# EAGLE schematic Main board V4.0 (EAGLE 6.2)

## Sheet 1 of 4
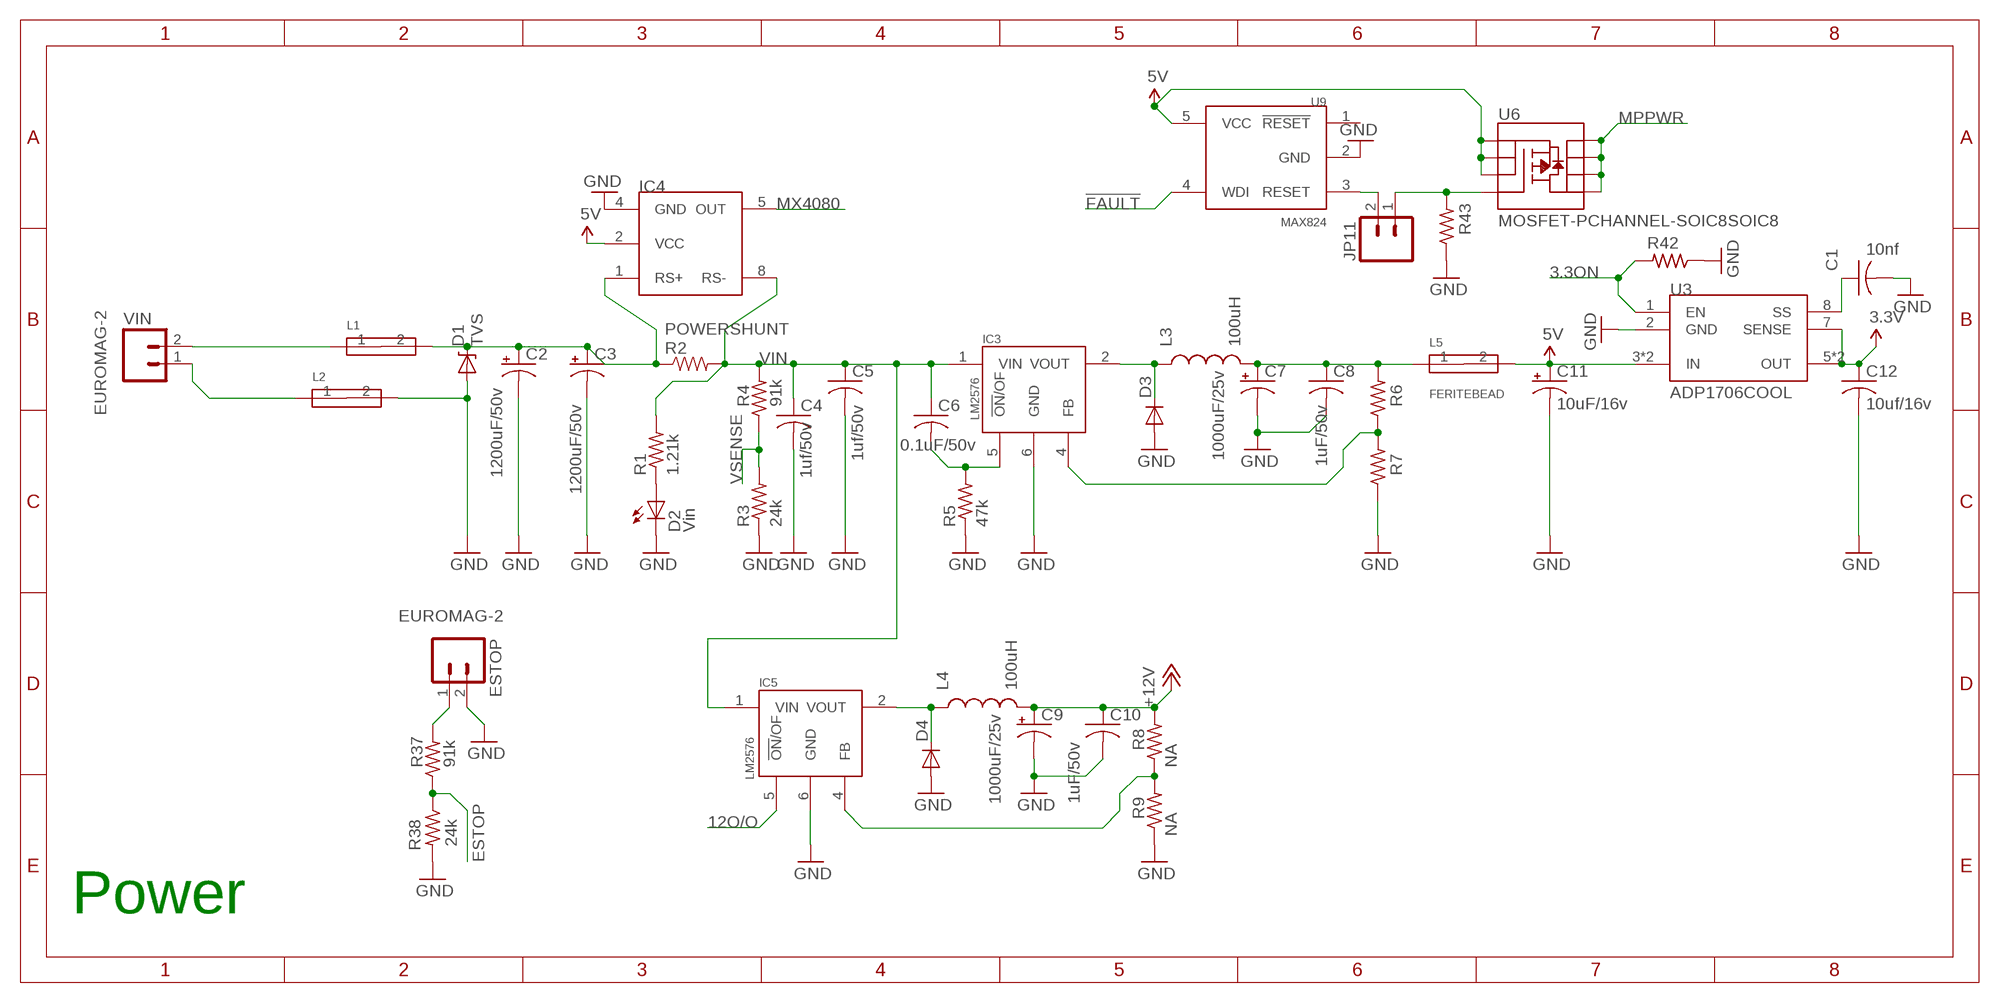
[diagram p0: schematic, sheet 1]

### Parts
C1  10nf  C-USC0805  [C0805]
C2  1200uF/50v  CAP_CAN1  [CAN_18MM]
C3  1200uF/50v  CAP_CAN1  [CAN_18MM]
C4  1uf/50v  C-USC0805  [C0805]
C5  1uf/50v  C-USC0805  [C0805]
C6  0.1uF/50v  C-USC0805  [C0805]
C7  1000uF/25v  CAP_CAN1  [CAN_18MM]
C8  1uF/50v  C-USC0805  [C0805]
C9  1000uF/25v  CAP_CAN1  [CAN_18MM]
C10  1uF/50v  C-USC0805  [C0805]
C11  10uF/16v  CPOL-USE3.5-10  [E3,5-10]
C12  10uf/16v  C-USC0805  [C0805]
D1  TVS  [DO-214AC]
D2  Vin  LEDCHIP-LED0805  [CHIP-LED0805]
D3  DIODE-SMC  [SMC]
D4  DIODE-SMC  [SMC]
ESTOP  EUROMAG-2  [M2]
IC3  LM2576  [TO-263-5]
IC4  MAX4080  [SO08]
IC5  LM2576  [TO-263-5]
JP11  M02LOCK_LONGPADS  [1X02_LOCK_LONGPADS]
L1  FERITEBEAD  [0603]
L2  FERITEBEAD  [0603]
L3  100uH  INDUCTOR  [INDUCTOR_5X3]
L4  100uH  INDUCTOR  [INDUCTOR_5X3]
L5  FERITEBEAD  [0603]
R1  1.21k  R-US_R0805  [R0805]
R2  POWERSHUNT  [RW3R5EAR100JE]
R3  24k  R-US_R0805  [R0805]
R4  91k  R-US_R0805  [R0805]
R5  47k  R-US_R0805  [R0805]
R6  NA  R-US_R0805  [R0805]
R7  NA  R-US_R0805  [R0805]
R8  NA  R-US_R0805  [R0805]
R9  NA  R-US_R0805  [R0805]
R37  91k  R-US_R0805  [R0805]
R38  24k  R-US_R0805  [R0805]
R42  NA  R-US_R0805  [R0805]
R43  NA  R-US_R0805  [R0805]
U3  ADP1706COOL  [SO-8COOL]
U6  MOSFET-PCHANNEL-SOIC8SOIC8  [SO08]
U9  MAX824  [SOT-5L]
VIN  EUROMAG-2  [M2]

### Nets
3.3ON: R42.2 U3.1(EN) ; also sheet 2
3.3V: C12.1 U3.5(OUT) U3.6(OUT) U3.7(SENSE) ; also sheet 2,3
5V: C11.+ IC4.2(VCC) L5.2 U3.3(IN) U3.4(IN) U6.1(S) U6.2(S) U6.3(S) U9.5(VCC) ; also sheet 2,3,4
12O/O: IC5.5(!ON!/OF) ; also sheet 2
!FAULT: U9.4(WDI) ; also sheet 2
+12V: C9.+ C10.1 L4.2 R8.2 ; also sheet 2,3
ESTOP: R37.1 R38.1 ; also sheet 3
GND: C1.2 C2.- C3.- C4.2 C5.2 C7.- C8.2 C9.- C10.2 C11.- C12.2 D1.A D2.C D3.A D4.A ESTOP.2 IC3.6(GND) IC4.4(GND) IC5.6(GND) L2.2 R3.1 R5.1 R7.1 R9.1 R38.2 R42.1 R43.1 U3.2(GND) U9.2(GND) ; also sheet 2,3,4
MPPWR: U6.5(D) U6.6(D) U6.7(D) U6.8(D) ; also sheet 2,3
MX4080: IC4.5(OUT) ; also sheet 3
N$1: C6.2 IC3.5(!ON!/OF) R5.2
N$4: D4.C IC5.2(VOUT) L4.1
N$19: D3.C IC3.2(VOUT) L3.1
N$20: JP11.1 R43.2 U6.4(G)
N$21: JP11.2 U9.3(RESET)
N$25: L1.1 VIN.2
N$27: ESTOP.1 R37.2
N$33: C2.+ C3.+ D1.C IC4.1(RS+) L1.2 R2.1
N$37: IC3.4(FB) R6.1 R7.2
N$38: IC5.4(FB) R8.1 R9.2
N$42: D2.A R1.1
N$45: L2.1 VIN.1
N$46: C7.+ C8.1 L3.2 L5.1 R6.2
N$78: C1.1 U3.8(SS)
VIN [power]: C4.1 C5.1 C6.1 IC3.1(VIN) IC4.8(RS-) IC5.1(VIN) R1.2 R2.2 R4.2
VSENSE: R3.2 R4.1 ; also sheet 3
Unconnected: U9.1(!RESET)

### Notes on the sheet
- IC4
- Power

## Sheet 2 of 4
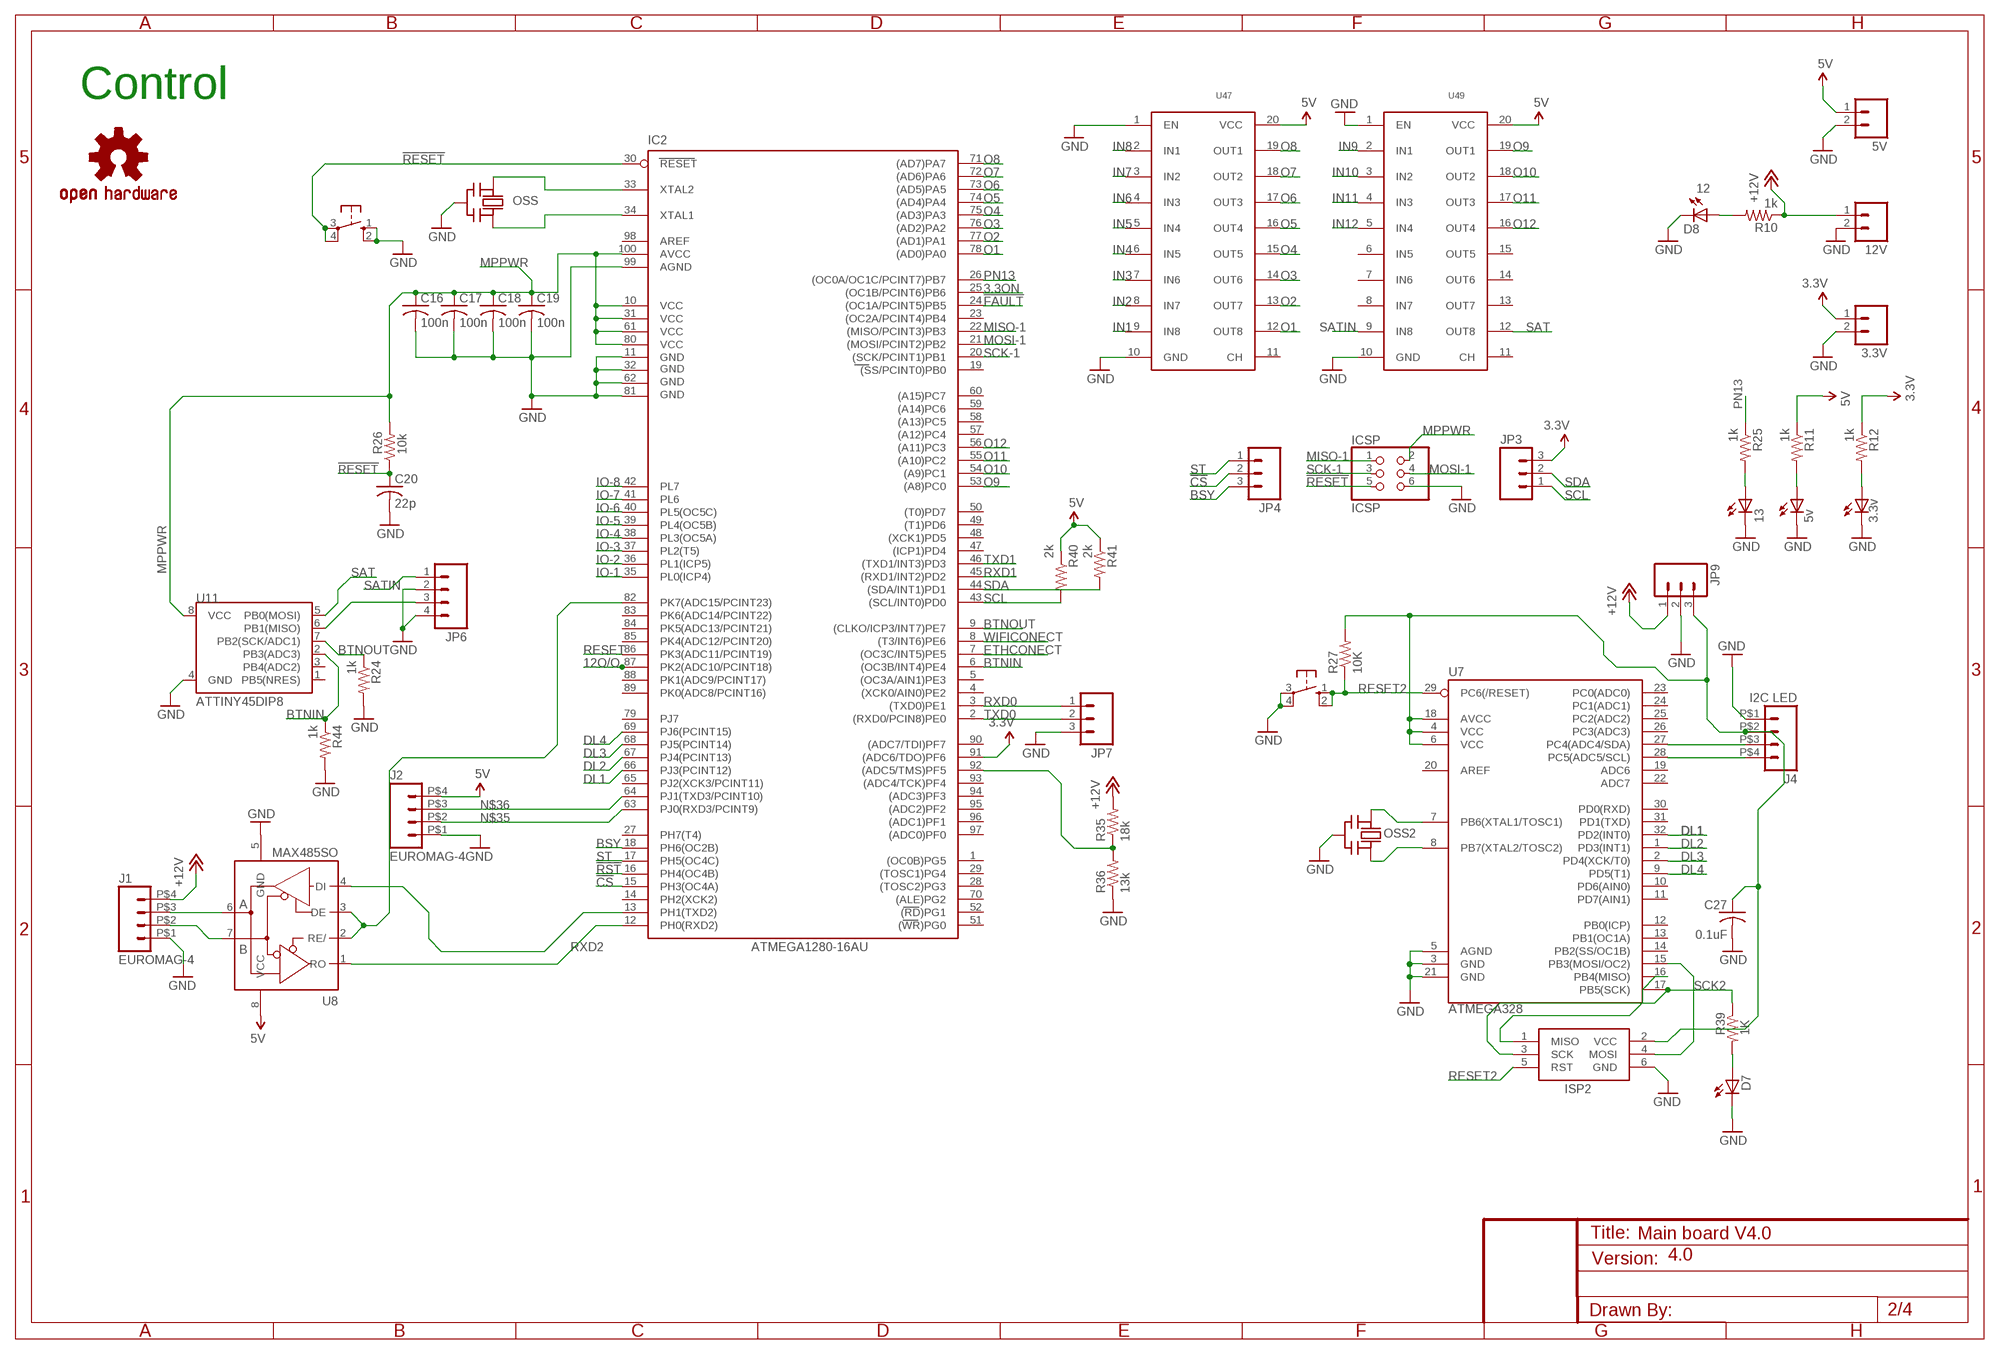
[diagram p1: schematic, sheet 2]

### Parts
3.3V  EUROMAG-2  [M2]
5V  EUROMAG-2  [M2]
12V  EUROMAG-2  [M2]
13  LEDCHIP-LED0805  [CHIP-LED0805]
C16  100n  C-USC0805  [C0805]
C17  100n  C-USC0805  [C0805]
C18  100n  C-USC0805  [C0805]
C19  100n  C-USC0805  [C0805]
C20  22p  C-USC0805  [C0805]
C27  0.1uF  C-USC0805  [C0805]
D5  5v  LEDCHIP-LED0805  [CHIP-LED0805]
D6  3.3v  LEDCHIP-LED0805  [CHIP-LED0805]
D7  LEDCHIP-LED0805  [CHIP-LED0805]
D8  12  LEDCHIP-LED0805  [CHIP-LED0805]
IC2  ATMEGA1280-16AU  [TQFP100]
ICSP  ICSP  PINHD-2X3  [2X03]
ISP2  AVRISP-6  [AVRISP]
J1  EUROMAG-4  [M4]
J2  EUROMAG-4  [M4]
J4  I2C LED  EUROMAG-4  [M4]
JP3  M03PTH  [1X03]
JP4  M03PTH  [1X03]
JP6  M04LOCK_LONGPADS  [1X04_LOCK_LONGPADS]
JP7  M03LOCK  [1X03_LOCK]
JP9  M03LOCK_LONGPADS  [1X03_LOCK_LONGPADS]
OSS  CERMOSCILL-AWCSR  [AWCSR]
OSS2  CERMOSCILL-AWCSR  [AWCSR]
R10  1k  R-US_R0805  [R0805]
R11  1k  R-US_R0805  [R0805]
R12  1k  R-US_R0805  [R0805]
R24  1k  R-US_R0805  [R0805]
R25  1k  R-US_R0805  [R0805]
R26  10k  R-US_R0805  [R0805]
R27  10K  RESISTOR  [0805]
R35  18k  R-US_R0805  [R0805]
R36  13k  R-US_R0805  [R0805]
R39  1K  RESISTOR  [0805]
R40  2k  R-US_R0805  [R0805]
R41  2k  R-US_R0805  [R0805]
R44  1k  R-US_R0805  [R0805]
S1  10-XX  [B3F-10XX]
S4  10-XX  [B3F-10XX]
U7  ATMEGA328  ATMEGA168  [TQFP32-08]
U8  MAX485SO  [SO08]
U11  ATTINY45DIP8  [DIP08]
U47  MAX6818  [SSOP-20]
U49  MAX6818  [SSOP-20]
U$3  OSHW-LOGOL  [OSHW-LOGO-L]

### Nets
3.3ON: IC2.25((OC1B/PCINT6)PB6) ; also sheet 1
3.3V: 3.3V.1 IC2.91((ADC6/TDO)PF6) JP3.3 R12.1 ; also sheet 1,3
5V: 5V.1 J2.P$4 R11.1 R40.1 R41.1 U8.8(VCC) U47.20(VCC) U49.20(VCC) ; also sheet 1,3,4
12O/O: IC2.87(PK2(ADC10/PCINT18)) ; also sheet 1
!CS: IC2.15(PH3(OC4A)) JP4.2
!FAULT: IC2.24((OC1A/PCINT5)PB5) ; also sheet 1
!RESET: C20.1 IC2.30(RESET) ICSP.5 R26.1 S1.3(P) S1.4(P1)
!RST: IC2.16(PH4(OC4B)) ; also sheet 3
+12V: 12V.1 J1.P$4 JP9.1 R10.1 R35.2 ; also sheet 1,3
BSY: IC2.18(PH6(OC2B)) JP4.3
BTNIN: IC2.6((OC3B/INT4)PE4) R44.1 U11.2(PB3(ADC3))
BTNOUT: IC2.9((CLKO/ICP3/INT7)PE7) R24.1 U11.7(PB2(SCK/ADC1))
DL1: IC2.66(PJ3(PCINT12)) U7.32(PD2(INT0))
DL2: IC2.67(PJ4(PCINT13)) U7.1(PD3(INT1))
DL3: IC2.68(PJ5(PCINT14)) U7.2(PD4(XCK/T0))
DL4: IC2.69(PJ6(PCINT15)) U7.9(PD5(T1))
ETHCONECT: IC2.7((OC3C/INT5)PE5) ; also sheet 3
GND: 3.3V.2 5V.2 12V.2 13.C C16.2 C17.2 C18.2 C19.2 C20.2 C27.2 D5.C D6.C D7.C D8.C IC2.11(GND) IC2.32(GND1) IC2.62(GND2) IC2.81(GND3) IC2.99(AGND) ICSP.6 ISP2.6(GND) J1.P$1 J2.P$1 J4.P$1 JP6.2 JP6.4 JP7.3 JP9.2 OSS2.2(GND) OSS.2(GND) R24.2 R36.1 R44.2 S1.1(S) S1.2(S1) S4.3(P) S4.4(P1) U7.3(GND) U7.5(AGND) U7.21(GND) U8.5(GND) U11.4(GND) U47.1(EN) U47.10(GND) U49.1(EN) U49.10(GND) ; also sheet 1,3,4
IN1: U47.9(IN8) ; also sheet 4
IN2: U47.8(IN7) ; also sheet 4
IN3: U47.7(IN6) ; also sheet 4
IN4: U47.6(IN5) ; also sheet 4
IN5: U47.5(IN4) ; also sheet 4
IN6: U47.4(IN3) ; also sheet 4
IN7: U47.3(IN2) ; also sheet 4
IN8: U47.2(IN1) ; also sheet 4
IN9: U49.2(IN1) ; also sheet 4
IN10: U49.3(IN2) ; also sheet 4
IN11: U49.4(IN3) ; also sheet 4
IN12: U49.5(IN4) ; also sheet 4
IO-1: IC2.35(PL0(ICP4)) ; also sheet 4
IO-2: IC2.36(PL1(ICP5)) ; also sheet 4
IO-3: IC2.37(PL2(T5)) ; also sheet 4
IO-4: IC2.38(PL3(OC5A)) ; also sheet 4
IO-5: IC2.39(PL4(OC5B)) ; also sheet 4
IO-6: IC2.40(PL5(OC5C)) ; also sheet 4
IO-7: IC2.41(PL6) ; also sheet 4
IO-8: IC2.42(PL7) ; also sheet 4
MISO-1: IC2.22((MISO/PCINT3)PB3) ICSP.1
MOSI-1: IC2.21((MOSI/PCINT2)PB2) ICSP.4
MPPWR: C16.1 C17.1 C18.1 C19.1 IC2.10(VCC) IC2.31(VCC1) IC2.61(VCC2) IC2.80(VCC3) IC2.100(AVCC) ICSP.2 R26.2 U11.8(VCC) ; also sheet 1,3
N$2: 13.A R25.2
N$3: D5.A R11.2
N$6: IC2.34(XTAL1) OSS.3(OUT)
N$7: IC2.33(XTAL2) OSS.1(IN)
N$9: IC2.92((ADC5/TMS)PF5) R35.1 R36.2
N$10: D8.A R10.2
N$26: D6.A R12.2
N$35: IC2.63(PJ0(RXD3/PCINT9)) J2.P$2
N$36: IC2.64(PJ1(TXD3/PCINT10)) J2.P$3
N$69: D7.A R39.2
N$71: OSS2.3(OUT) U7.8(PB7(XTAL2/TOSC2))
N$72: JP6.3 U11.6(PB1(MISO))
N$73: OSS2.1(IN) U7.7(PB6(XTAL1/TOSC1))
N$74: J4.P$4 U7.28(PC5(ADC5/SCL))
N$75: ISP2.4(MOSI) U7.15(PB3(MOSI/OC2))
N$76: ISP2.1(MISO) U7.16(PB4(MISO))
N$77: J4.P$3 U7.27(PC4(ADC4/SDA))
N$79: C27.1 ISP2.2(VCC) J4.P$2 JP9.3 R27.2 U7.4(VCC) U7.6(VCC) U7.18(AVCC)
N$81: J1.P$3 U8.6(A)
N$82: J1.P$2 U8.7(B)
N$83: IC2.82(PK7(ADC15/PCINT23)) U8.2(RE/) U8.3(DE)
O1: IC2.78((AD0)PA0) U47.12(OUT8)
O2: IC2.77((AD1)PA1) U47.13(OUT7)
O3: IC2.76((AD2)PA2) U47.14(OUT6)
O4: IC2.75((AD3)PA3) U47.15(OUT5)
O5: IC2.74((AD4)PA4) U47.16(OUT4)
O6: IC2.73((AD5)PA5) U47.17(OUT3)
O7: IC2.72((AD6)PA6) U47.18(OUT2)
O8: IC2.71((AD7)PA7) U47.19(OUT1)
O9: IC2.53((A8)PC0) U49.19(OUT1)
O10: IC2.54((A9)PC1) U49.18(OUT2)
O11: IC2.55((A10)PC2) U49.17(OUT3)
O12: IC2.56((A11)PC3) U49.16(OUT4)
PN13: IC2.26((OC0A/OC1C/PCINT7)PB7) R25.1
RESET: IC2.86(PK3(ADC11/PCINT19)) ; also sheet 3
RESET2: ISP2.5(RST) R27.1 S4.1(S) S4.2(S1) U7.29(PC6(/RESET))
RXD0: IC2.3((TXD0)PE1) JP7.1 ; also sheet 3
RXD1: IC2.45((RXD1/INT2)PD2) ; also sheet 3
RXD2: IC2.12(PH0(RXD2)) U8.1(RO)
SAT: U11.5(PB0(MOSI)) U49.12(OUT8)
SATIN: JP6.1 U49.9(IN8)
SCK2: ISP2.3(SCK) R39.1 U7.17(PB5(SCK))
SCK-1: IC2.20((SCK/PCINT1)PB1) ICSP.3
SCL: IC2.43((SCL/INT0)PD0) JP3.1 R40.2 ; also sheet 3
SDA: IC2.44((SDA/INT1)PD1) JP3.2 R41.2 ; also sheet 3
ST: IC2.17(PH5(OC4C)) JP4.1
TXD0: IC2.2((RXD0/PCIN8)PE0) JP7.2 ; also sheet 3
TXD1: IC2.46((TXD1/INT3)PD3) ; also sheet 3
TXD2: IC2.13(PH1(TXD2)) U8.4(DI)
WIFICONECT: IC2.8((T3/INT6)PE6) ; also sheet 3
Unconnected: IC2.1((OC0B)PG5) IC2.4((XCK0/AIN0)PE2) IC2.5((OC3A/AIN1)PE3) IC2.14(PH2(XCK2)) IC2.19((SS/PCINT0)PB0) IC2.23((OC2A/PCINT4)PB4) IC2.27(PH7(T4)) IC2.28((TOSC2)PG3) IC2.29((TOSC1)PG4) IC2.47((ICP1)PD4) IC2.48((XCK1)PD5) IC2.49((T1)PD6) IC2.50((T0)PD7) IC2.51((WR)PG0) IC2.52((RD)PG1) IC2.57((A12)PC4) IC2.58((A13)PC5) IC2.59((A14)PC6) IC2.60((A15)PC7) IC2.65(PJ2(XCK3/PCINT11)) IC2.70((ALE)PG2) IC2.79(PJ7) IC2.83(PK6(ADC14/PCINT22)) IC2.84(PK5(ADC13/PCINT21)) IC2.85(PK4(ADC12/PCINT20)) IC2.88(PK1(ADC9/PCINT17)) IC2.89(PK0(ADC8/PCINT16)) IC2.90((ADC7/TDI)PF7) IC2.93((ADC4/TCK)PF4) IC2.94((ADC3)PF3) IC2.95((ADC2)PF2) IC2.96((ADC1)PF1) IC2.97((ADC0)PF0) IC2.98(AREF) U7.10(PD6(AIN0)) U7.11(PD7(AIN1)) U7.12(PB0(ICP)) U7.13(PB1(OC1A)) U7.14(PB2(SS/OC1B)) U7.19(ADC6) U7.20(AREF) U7.22(ADC7) U7.23(PC0(ADC0)) U7.24(PC1(ADC1)) U7.25(PC2(ADC2)) U7.26(PC3(ADC3)) U7.30(PD0(RXD)) U7.31(PD1(TXD)) U11.1(PB5(NRES)) U11.3(PB4(ADC2)) U47.11(CH) U49.6(IN5) U49.7(IN6) U49.8(IN7) U49.11(CH) U49.13(OUT7) U49.14(OUT6) U49.15(OUT5)

### Notes on the sheet
- Control
- 4.0

## Sheet 3 of 4
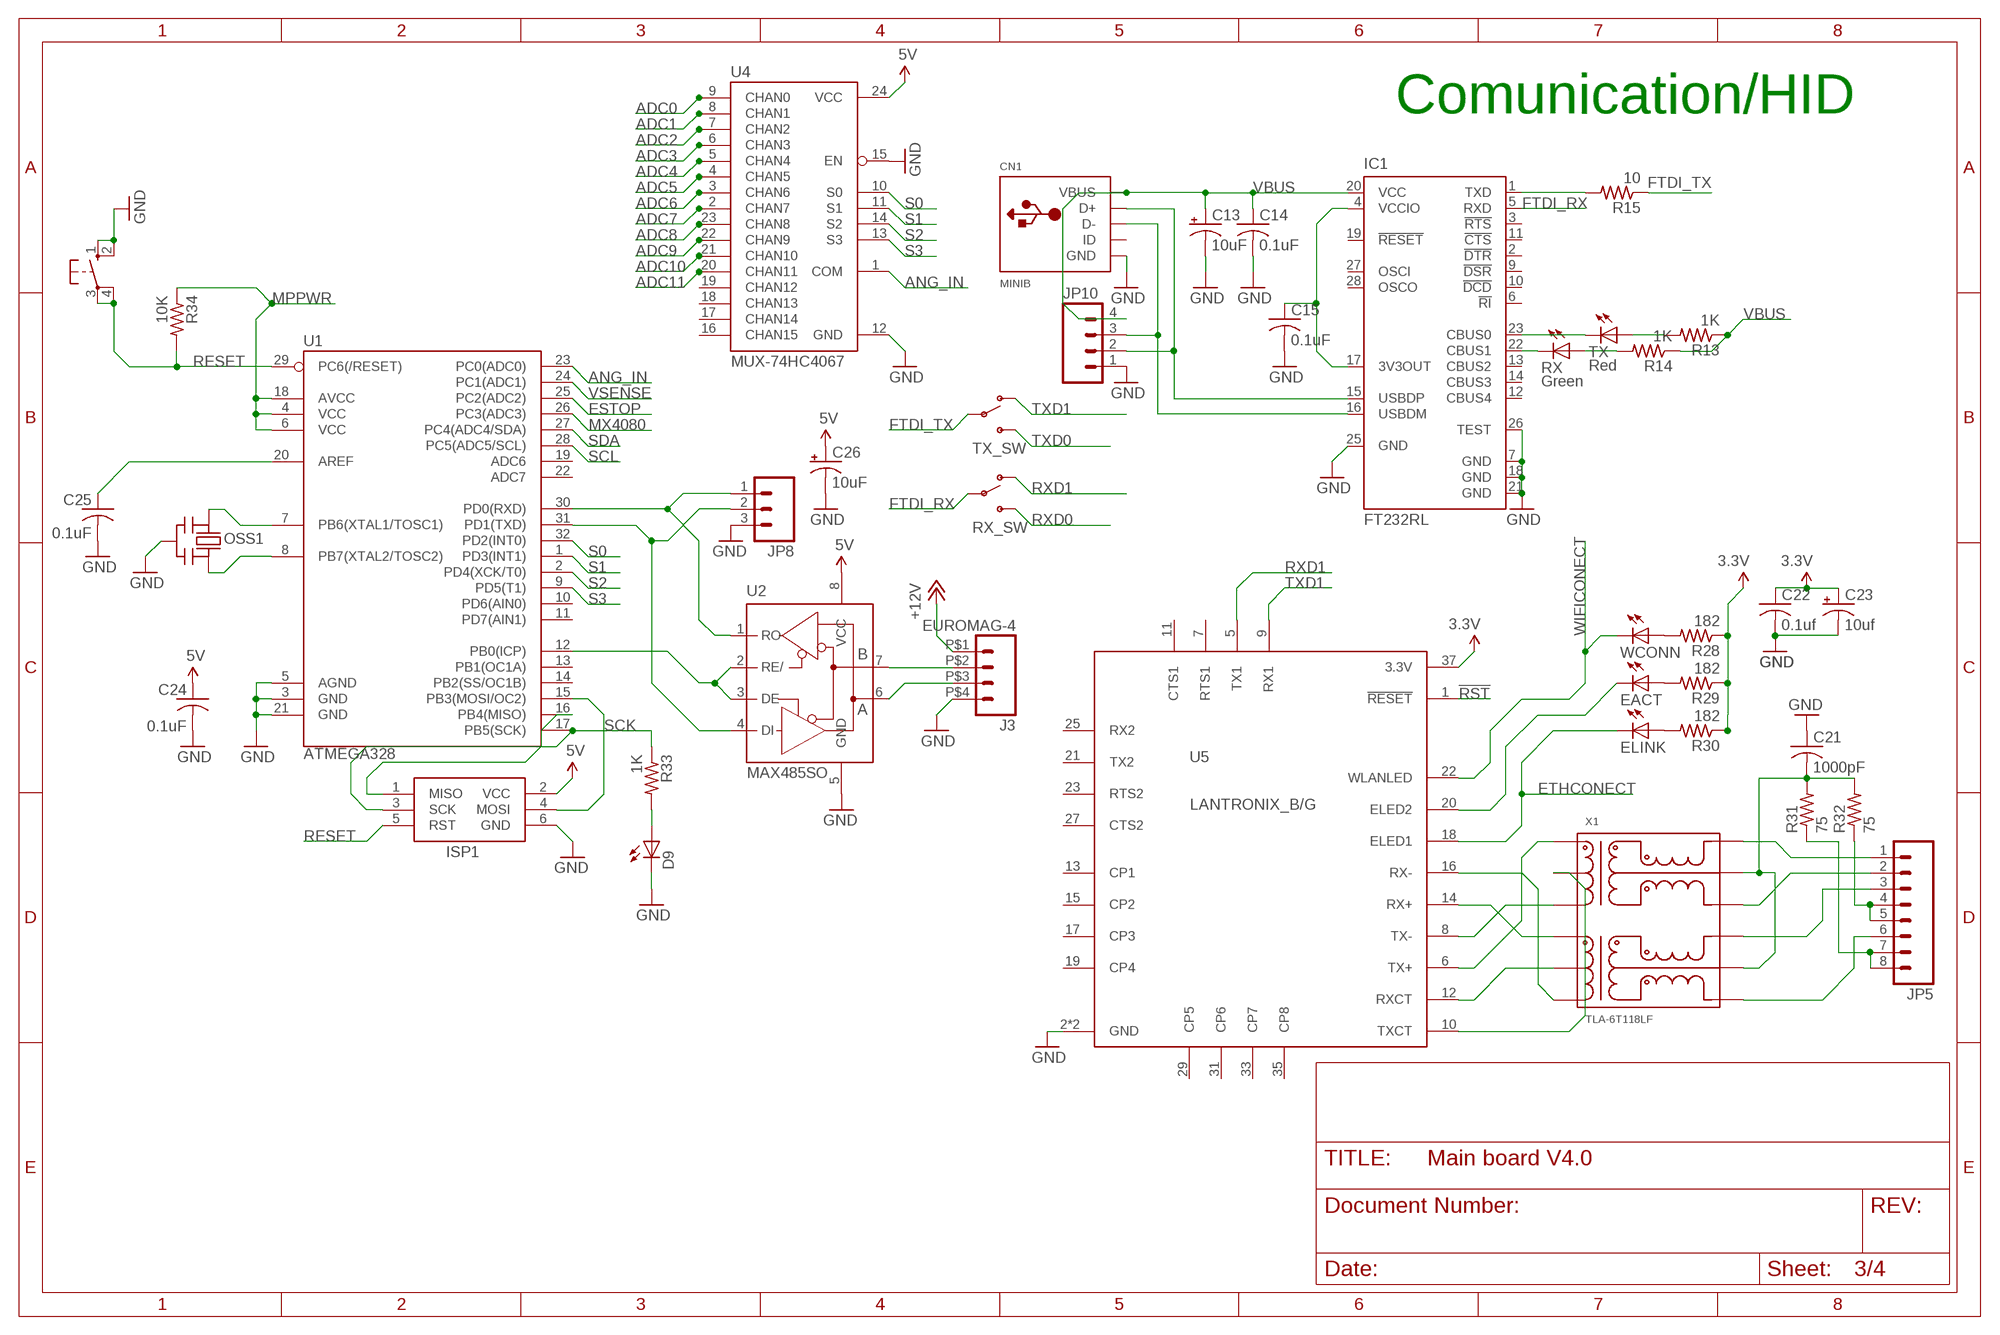
[diagram p2: schematic, sheet 3]

### Parts
C13  10uF  CPOL-USA/3216-18R  [A/3216-18R]
C14  0.1uF  C-USC0805K  [C0805K]
C15  0.1uF  C-USC0805K  [C0805K]
C21  1000pF  C-USC1812  [C1812]
C22  0.1uf  C-USC0805K  [C0805K]
C23  10uf  CAP_POL3528  [EIA3528]
C24  0.1uF  C-USC0805K  [C0805K]
C25  0.1uF  C-USC0805  [C0805]
C26  10uF  CAP_POL3528  [EIA3528]
CN1  MINIB  USBMINIB  [USB-MINIB]
D9  LEDCHIP-LED0805  [CHIP-LED0805]
EACT  LEDCHIP-LED0805  [CHIP-LED0805]
ELINK  LEDCHIP-LED0805  [CHIP-LED0805]
IC1  FT232RL  [SSOP28]
ISP1  AVRISP-6  [AVRISP]
J3  EUROMAG-4  [M4]
JP5  M08LOCK_LONGPADS  [1X08_LOCK_LONGPADS]
JP8  M03LOCK  [1X03_LOCK]
JP10  M04LONGPADS  [1X04_LONGPADS]
OSS1  CERMOSCILL-AWCSR  [AWCSR]
R13  1K  R-US_R0805  [R0805]
R14  1K  R-US_R0805  [R0805]
R15  10  R-US_R0805  [R0805]
R28  182  R-US_R0805  [R0805]
R29  182  R-US_R0805  [R0805]
R30  182  R-US_R0805  [R0805]
R31  75  R-US_R0805  [R0805]
R32  75  R-US_R0805  [R0805]
R33  1K  R-US_R0805  [R0805]
R34  10K  R-US_R0805  [R0805]
RX  Green  LEDCHIP-LED0805  [CHIP-LED0805]
RX_SW  SWITCH-SPSTKIT  [SWITCH-SPDT_KIT]
S3  10-XX  [B3F-10XX]
TX  Red  LEDCHIP-LED0805  [CHIP-LED0805]
TX_SW  SWITCH-SPSTKIT  [SWITCH-SPDT_KIT]
U1  ATMEGA328  ATMEGA168  [TQFP32-08]
U2  MAX485SO  [SO08]
U4  MUX-74HC4067  MUX-74HC4067SMD  [SSOP24]
U5  LANTRONIX_B/G  LANTRONIX_A/B  [LANA/BTH]
WCONN  LEDCHIP-LED0805  [CHIP-LED0805]
X1  TLA-6T118LF  [SO-16MOD]

### Nets
3.3V: C22.1 C23.A(+) R28.1 R29.1 R30.1 U5.37(3.3V) ; also sheet 1,2
5V: C24.1 C26.A(+) ISP1.2(VCC) U2.8(VCC) U4.24(VCC) ; also sheet 1,2,4
!RST: U5.1(!RESET) ; also sheet 2
+12V: J3.P$1 ; also sheet 1,2
ADC0: U4.9(CHAN0) ; also sheet 4
ADC1: U4.8(CHAN1) ; also sheet 4
ADC2: U4.7(CHAN2) ; also sheet 4
ADC3: U4.6(CHAN3) ; also sheet 4
ADC4: U4.5(CHAN4) ; also sheet 4
ADC5: U4.4(CHAN5) ; also sheet 4
ADC6: U4.3(CHAN6) ; also sheet 4
ADC7: U4.2(CHAN7) ; also sheet 4
ADC8: U4.23(CHAN8) ; also sheet 4
ADC9: U4.22(CHAN9) ; also sheet 4
ADC10: U4.21(CHAN10) ; also sheet 4
ADC11: U4.20(CHAN11) ; also sheet 4
ANG_IN: U1.23(PC0(ADC0)) U4.1(COM)
ESTOP: U1.25(PC2(ADC2)) ; also sheet 1
ETHCONECT: ELINK.C U5.18(ELED1) ; also sheet 2
FTDI_RX: IC1.5(RXD) RX_SW.2(P)
FTDI_TX: R15.1 TX_SW.2(P)
GND: C13.- C14.2 C15.2 C21.1 C22.2 C23.C(-) C24.2 C25.2 C26.C(-) CN1.GND D9.C IC1.7(GND) IC1.18(GND) IC1.21(GND) IC1.25(GND) IC1.26(TEST) ISP1.6(GND) J3.P$4 JP8.3 JP10.1 OSS1.2(GND) S3.1(S) S3.2(S1) U1.3(GND) U1.5(AGND) U1.21(GND) U2.5(GND) U4.12(GND) U4.15(EN) U5.2(GND) U5.39(GND) ; also sheet 1,2,4
MPPWR: R34.1 U1.4(VCC) U1.6(VCC) U1.18(AVCC) ; also sheet 1,2
MX4080: U1.26(PC3(ADC3)) ; also sheet 1
N$5: CN1.D+ IC1.15(USBDP) JP10.2
N$8: CN1.D- IC1.16(USBDM) JP10.3
N$22: IC1.23(CBUS0) TX.C
N$23: D9.A R33.2
N$24: IC1.22(CBUS1) RX.C
N$30: R14.2 RX.A
N$31: R13.2 TX.A
N$32: IC1.1(TXD) R15.2
N$34: C15.1 IC1.4(VCCIO) IC1.17(3V3OUT)
N$39: OSS1.3(OUT) U1.8(PB7(XTAL2/TOSC2))
N$40: OSS1.1(IN) U1.7(PB6(XTAL1/TOSC1))
N$41: C25.1 U1.20(AREF)
N$43: ISP1.4(MOSI) U1.15(PB3(MOSI/OC2))
N$44: ISP1.1(MISO) U1.16(PB4(MISO))
N$47: J3.P$2 U2.7(B)
N$49: J3.P$3 U2.6(A)
N$50: U1.12(PB0(ICP)) U2.2(RE/) U2.3(DE)
N$51: JP8.1 U1.30(PD0(RXD)) U2.1(RO)
N$52: JP8.2 U1.31(PD1(TXD)) U2.4(DI)
N$53: U5.8(TX-) X1.3
N$54: U5.6(TX+) X1.1
N$55: U5.14(RX+) X1.6
N$56: U5.16(RX-) X1.8
N$57: U5.12(RXCT) X1.7
N$58: U5.10(TXCT) X1.2
N$59: JP5.4 JP5.5 R32.1
N$60: JP5.7 JP5.8 R31.1
N$61: JP5.6 X1.9
N$62: JP5.3 X1.11
N$63: JP5.2 X1.14
N$64: JP5.1 X1.16
N$65: C21.2 R31.2 R32.2 X1.10 X1.15
N$66: ELINK.A R30.2
N$67: EACT.A R29.2
N$68: R28.2 WCONN.A
N$70: EACT.C U5.20(ELED2)
RESET: ISP1.5(RST) R34.2 S3.3(P) S3.4(P1) U1.29(PC6(/RESET)) ; also sheet 2
RXD0: RX_SW.3(S) ; also sheet 2
RXD1: RX_SW.1(O) U5.5(TX1) ; also sheet 2
S0: U1.32(PD2(INT0)) U4.10(S0)
S1: U1.1(PD3(INT1)) U4.11(S1)
S2: U1.2(PD4(XCK/T0)) U4.14(S2)
S3: U1.9(PD5(T1)) U4.13(S3)
SCK: ISP1.3(SCK) R33.1 U1.17(PB5(SCK))
SCL: U1.28(PC5(ADC5/SCL)) ; also sheet 2
SDA: U1.27(PC4(ADC4/SDA)) ; also sheet 2
TXD0: TX_SW.3(S) ; also sheet 2
TXD1: TX_SW.1(O) U5.9(RX1) ; also sheet 2
VBUS: C13.+ C14.1 CN1.VBUS IC1.20(VCC) JP10.4 R13.1 R14.1
VSENSE: U1.24(PC1(ADC1)) ; also sheet 1
WIFICONECT: U5.22(WLANLED) WCONN.C ; also sheet 2
Unconnected: CN1.ID IC1.2(!DTR) IC1.3(!RTS) IC1.6(!RI) IC1.9(!DSR) IC1.10(!DCD) IC1.11(!CTS) IC1.12(CBUS4) IC1.13(CBUS2) IC1.14(CBUS3) IC1.19(!RESET) IC1.27(OSCI) IC1.28(OSCO) U1.10(PD6(AIN0)) U1.11(PD7(AIN1)) U1.13(PB1(OC1A)) U1.14(PB2(SS/OC1B)) U1.19(ADC6) U1.22(ADC7) U4.16(CHAN15) U4.17(CHAN14) U4.18(CHAN13) U4.19(CHAN12) U5.7(RTS1) U5.11(CTS1) U5.13(CP1) U5.15(CP2) U5.17(CP3) U5.19(CP4) U5.21(TX2) U5.23(RTS2) U5.25(RX2) U5.27(CTS2) U5.29(CP5) U5.31(CP6) U5.33(CP7) U5.35(CP8)

### Notes on the sheet
- Comunication/HID

## Sheet 4 of 4
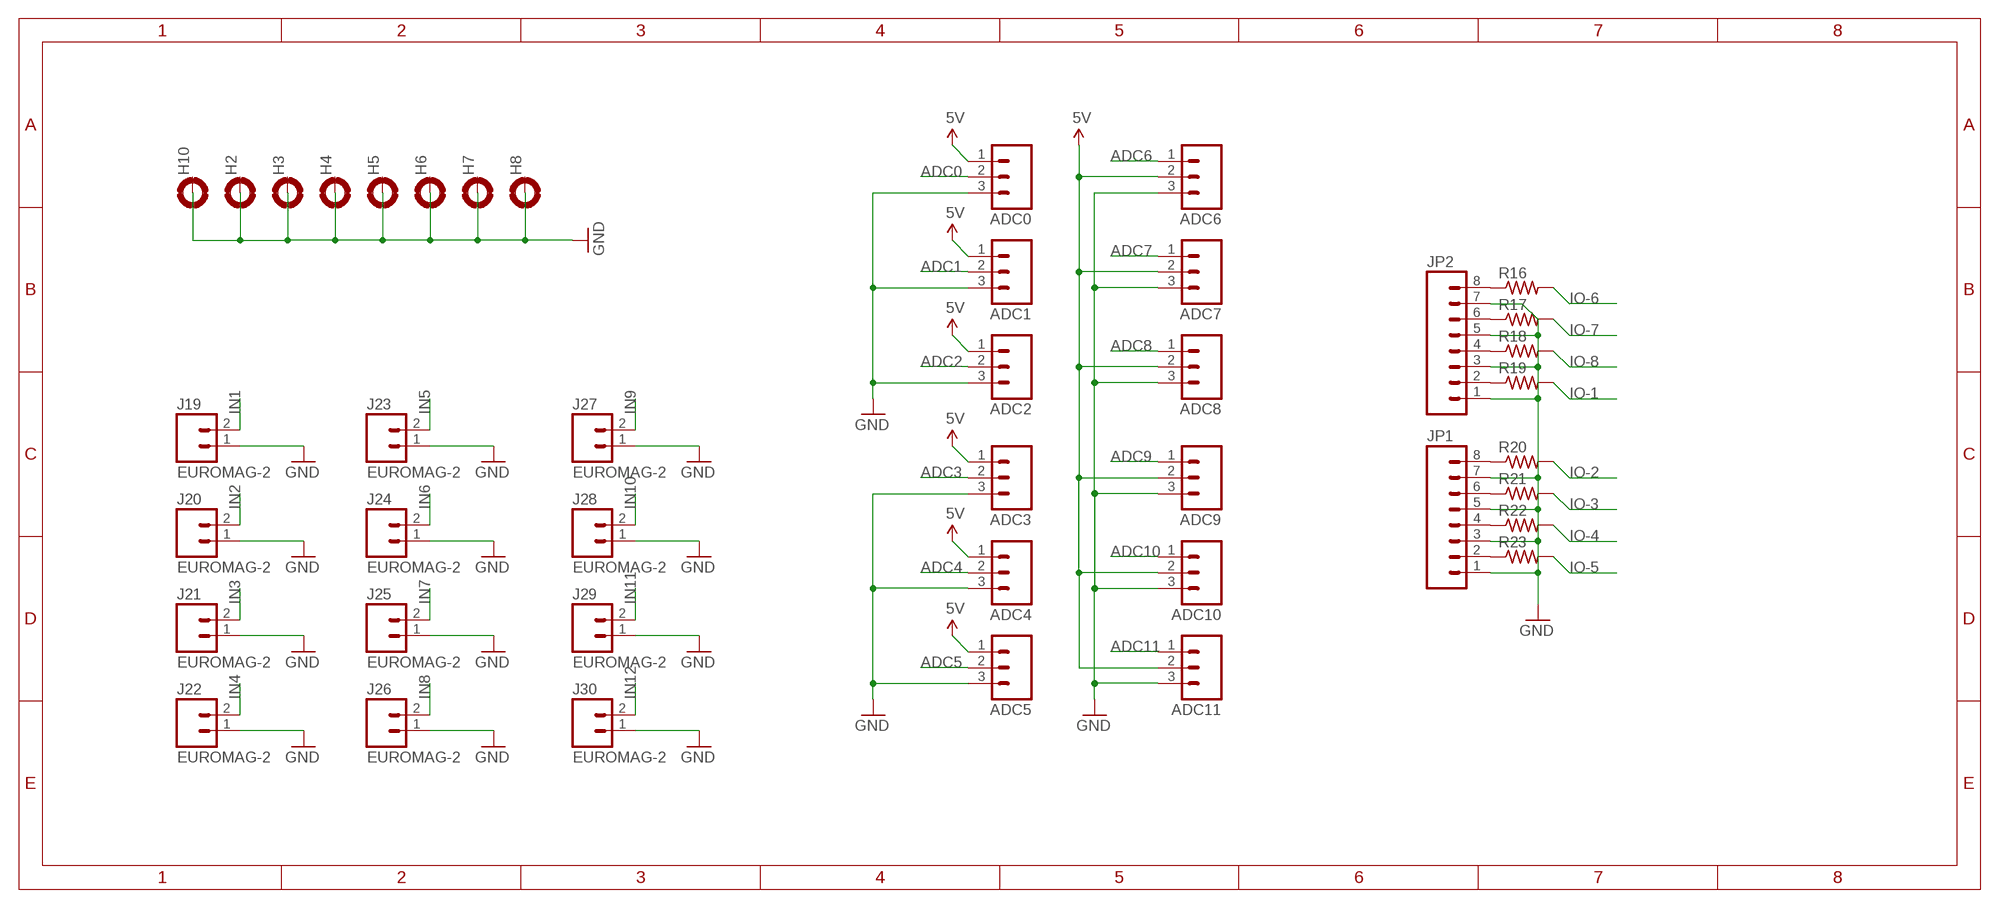
[diagram p3: schematic, sheet 4]

### Parts
ADC0  EUROMAG-390DEG  [M3]
ADC1  EUROMAG-390DEG  [M3]
ADC2  EUROMAG-390DEG  [M3]
ADC3  EUROMAG-390DEG  [M3]
ADC4  EUROMAG-390DEG  [M3]
ADC5  EUROMAG-390DEG  [M3]
ADC6  M03PTH  [1X03]
ADC7  M03PTH  [1X03]
ADC8  M03PTH  [1X03]
ADC9  M03PTH  [1X03]
ADC10  M03PTH  [1X03]
ADC11  M03PTH  [1X03]
H2  MOUNT-PAD-ROUND2.8  [2,8-PAD]
H3  MOUNT-PAD-ROUND2.8  [2,8-PAD]
H4  MOUNT-PAD-ROUND2.8  [2,8-PAD]
H5  MOUNT-PAD-ROUND2.8  [2,8-PAD]
H6  MOUNT-PAD-ROUND2.8  [2,8-PAD]
H7  MOUNT-PAD-ROUND2.8  [2,8-PAD]
H8  MOUNT-PAD-ROUND2.8  [2,8-PAD]
H10  MOUNT-PAD-ROUND2.8  [2,8-PAD]
J19  EUROMAG-2  [M2]
J20  EUROMAG-2  [M2]
J21  EUROMAG-2  [M2]
J22  EUROMAG-2  [M2]
J23  EUROMAG-2  [M2]
J24  EUROMAG-2  [M2]
J25  EUROMAG-2  [M2]
J26  EUROMAG-2  [M2]
J27  EUROMAG-2  [M2]
J28  EUROMAG-2  [M2]
J29  EUROMAG-2  [M2]
J30  EUROMAG-2  [M2]
JP1  M08LOCK  [1X08_LOCK]
JP2  M08LOCK  [1X08_LOCK]
R16  R-US_FLIPFLOP  [0805-THM]
R17  R-US_FLIPFLOP  [0805-THM]
R18  R-US_FLIPFLOP  [0805-THM]
R19  R-US_FLIPFLOP  [0805-THM]
R20  R-US_FLIPFLOP  [0805-THM]
R21  R-US_FLIPFLOP  [0805-THM]
R22  R-US_FLIPFLOP  [0805-THM]
R23  R-US_FLIPFLOP  [0805-THM]

### Nets
5V: ADC0.1 ADC1.1 ADC2.1 ADC3.1 ADC4.1 ADC5.1 ADC6.2 ADC7.2 ADC8.2 ADC9.2 ADC10.2 ADC11.2 ; also sheet 1,2,3
ADC0: ADC0.2 ; also sheet 3
ADC1: ADC1.2 ; also sheet 3
ADC2: ADC2.2 ; also sheet 3
ADC3: ADC3.2 ; also sheet 3
ADC4: ADC4.2 ; also sheet 3
ADC5: ADC5.2 ; also sheet 3
ADC6: ADC6.1 ; also sheet 3
ADC7: ADC7.1 ; also sheet 3
ADC8: ADC8.1 ; also sheet 3
ADC9: ADC9.1 ; also sheet 3
ADC10: ADC10.1 ; also sheet 3
ADC11: ADC11.1 ; also sheet 3
GND: ADC0.3 ADC1.3 ADC2.3 ADC3.3 ADC4.3 ADC5.3 ADC6.3 ADC7.3 ADC8.3 ADC9.3 ADC10.3 ADC11.3 H2.B2,8(MOUNT) H3.B2,8(MOUNT) H4.B2,8(MOUNT) H5.B2,8(MOUNT) H6.B2,8(MOUNT) H7.B2,8(MOUNT) H8.B2,8(MOUNT) H10.B2,8(MOUNT) J19.1 J20.1 J21.1 J22.1 J23.1 J24.1 J25.1 J26.1 J27.1 J28.1 J29.1 J30.1 JP1.1 JP1.3 JP1.5 JP1.7 JP2.1 JP2.3 JP2.5 JP2.7 ; also sheet 1,2,3
IN1: J19.2 ; also sheet 2
IN2: J20.2 ; also sheet 2
IN3: J21.2 ; also sheet 2
IN4: J22.2 ; also sheet 2
IN5: J23.2 ; also sheet 2
IN6: J24.2 ; also sheet 2
IN7: J25.2 ; also sheet 2
IN8: J26.2 ; also sheet 2
IN9: J27.2 ; also sheet 2
IN10: J28.2 ; also sheet 2
IN11: J29.2 ; also sheet 2
IN12: J30.2 ; also sheet 2
IO-1: R19.2 ; also sheet 2
IO-2: R20.2 ; also sheet 2
IO-3: R21.2 ; also sheet 2
IO-4: R22.2 ; also sheet 2
IO-5: R23.2 ; also sheet 2
IO-6: R16.2 ; also sheet 2
IO-7: R17.2 ; also sheet 2
IO-8: R18.2 ; also sheet 2
N$11: JP1.8 R20.1
N$12: JP1.6 R21.1
N$13: JP1.4 R22.1
N$14: JP1.2 R23.1
N$15: JP2.2 R19.1
N$16: JP2.4 R18.1
N$17: JP2.6 R17.1
N$18: JP2.8 R16.1

## Library data of the parts
3.3V 5V 12V ESTOP J19-J30 VIN = RJ's_parts:EUROMAG-2
13 D2 D5-D9 EACT ELINK RX TX WCONN = adafruit:LED: LED OSRAM: - CHIPLED LG R971, LG N971, LY N971, LG Q971, LY Q971, LO R971, LY R971 LH N974, LH R974 LS Q976, LO Q976, LY Q976 LO Q996 - Hyper CHIPLED LW Q18S LB Q993, LB Q99A, LB R99A - SideLED LS A670, LO A670, LY A670, LG A670, LP A670 LB A673, LV A673, LT A673, LW A673 LH A674 LY A675 LS A676, LA A676, LO A676, LY A676, LW A676 LS A679, LY A679, LG A679 - Hyper Micro SIDELED® LS Y876, LA Y876, LO Y876, LY Y876 LT Y87S - SmartLED LW L88C, LW L88S LB L89C, LB L89S, LG L890 LS L89K, LO L89K, LY L89K LS L896, LA L896, LO L896, LY L896 - TOPLED LS T670, LO T670, LY T670, LG T670, LP T670 LSG T670, LSP T670, LSY T670, LOP T670, LYG T670 LG T671, LOG T671, LSG T671 LB T673, LV T673, LT T673, LW T673 LH T674 LS T676, LA T676, LO T676, LY T676, LB T676, LH T676, LSB T676, LW T676 LB T67C, LV T67C, LT T67C, LS T67K, LO T67K, LY T67K, LW E67C LS E67B, LA E67B, LO E67B, LY E67B, LB E67C, LV E67C, LT E67C LW T67C LS T679, LY T679, LG T679 LS T770, LO T770, LY T770, LG T770, LP T770 LB T773, LV T773, LT T773, LW T773 LH T774 LS E675, LA E675, LY E675, LS T675 LS T776, LA T776, LO T776, LY T776, LB T776 LHGB T686 LT T68C, LB T68C - Hyper Mini TOPLED® LB M676 - Mini TOPLED Santana® LG M470 LS M47K, LO M47K, LY M47K Source: http://www.osram.convergy.de/
ADC0 ADC1-ADC5 = RJ's_parts:EUROMAG-3
ADC6-ADC11 JP3 JP4 JP7-JP9 = SparkFun:M03: Header 3 Standard 3-pin 0.1" header. Use with straight break away headers (SKU : PRT-00116), right angle break away headers (PRT-00553), swiss pins (PRT-00743), machine pins (PRT-00117), and female headers (PRT-00115). Molex polarized connector foot print use with SKU : PRT-08232 with associated crimp pins and housings.
C1 C4-C6 C8 C10 C12 C14-C22 C24 C25 C27 = adafruit:C-US: CAPACITOR, American symbol
C2 C3 C7 C9 = NASA_LIB:CAP_CAN
C11 C13 = adafruit:CPOL-US: POLARIZED CAPACITOR, American symbol
C23 C26 = SparkFun:CAP_POL: Capacitor Polarized These are standard SMD and PTH capacitors. Normally 10uF, 47uF, and 100uF in electrolytic and tantalum varieties. Always verify the external diameter of the through hole cap, it varies with capacity, voltage, and manufacturer. The EIA devices should be standard.
CN1 = adafruit:USB: USB Connectors USBMINIB - Surface Mount Female Mini-B USB Connector 4UConnector: 06564 By microbuilder.eu Thru-hole RA Female Mini-B USB Connector 4UConnector: 18732 By ladyada.net
D1 = NASA_LIB:TVS
D3 D4 = diode:DIODE-: DIODE
H2-H8 H10 = holes:MOUNT-PAD-ROUND: MOUNTING PAD, round
IC1 = ftdichip:FT232R: Source: http://www.ftdichip.com/Documents/DataSheets/DS_FT232R_v104.pdf
IC2 = atmel-2005:ATMEGA*: MICROCONTROLLER 64/128/256 Kbytes FLASH 4 Kbytes EEPROM 8 Kbytes SRAM 86 General Purpose I/O pins 12-channels16-bit PWM 4 x Serial USARTs 16-channels 10-bit A/D
IC3 IC5 = NASA_LIB:LM2576
IC4 = RJ's parts:MAX4080
ICSP = pinhead:PINHD-2X3: PIN HEADER
ISP1 ISP2 = adafruit:AVRISP: AVR ISP HEADER Standard 6 pin header for AVR programming
J1 J2 = RJ's_parts:EUROMAG-4
J3 J4 = NASA_LIB:EUROMAG-4
JP1 JP2 JP5 = SparkFun:M08: Header 8 Standard 8-pin 0.1" header. Use with straight break away headers (SKU : PRT-00116), right angle break away headers (PRT-00553), swiss pins (PRT-00743), machine pins (PRT-00117), and female headers (PRT-00115).
JP6 JP10 = SparkFun:M04: Header 4 Standard 4-pin 0.1" header. Use with straight break away headers (SKU : PRT-00116), right angle break away headers (PRT-00553), swiss pins (PRT-00743), machine pins (PRT-00117), and female headers (PRT-00115). Molex polarized connector foot print use with SKU : PRT-08231 with associated crimp pins and housings. 1MM SMD Version SKU: PRT-10208
JP11 = SparkFun:M02: Header 2 Standard 2-pin 0.1" header. Use with straight break away headers (SKU : PRT-00116), right angle break away headers (PRT-00553), swiss pins (PRT-00743), machine pins (PRT-00117), and female headers (PRT-00115). Molex polarized connector foot print use with SKU : PRT-08233 with associated crimp pins and housings.
L1 L2 L5 = EmEndev:FERITEBEAD
L3 L4 = NASA_LIB:INDUCTOR
OSS OSS1 OSS2 = adafruit:CERMOSCILL: Ceramic oscillator with built in capacitors such as ZTT-12MHz http://www.ladyada.net/library/eagle
R1 R3-R26 R28-R38 R40-R44 = adafruit:R-US_: RESISTOR, American symbol
R2 = NASA_LIB:POWERSHUNT
R27 R39 = SparkFun:RESISTOR: Resistor Basic schematic elements and footprints for 0603, 1206, and PTH 1/10th watt (small) resistors.
RX_SW TX_SW = SparkFun:SWITCH-SPST: SPST Switch Simple slide switch. Spark Fun Electronics SKU : COM-00102
S1 S3 S4 = switch-omron:10-XX: OMRON SWITCH
U1 U7 = SparkFun:ATMEGA168
U2 U8 = NASA_LIB:MAX485
U3 = NASA_LIB:ADP1706
U4 = SparkFun:MUX-74HC4067
U5 = NASA_LIB:LANTRONIX_A/B
U6 = SparkFun:MOSFET-PCHANNEL-SOIC8
U9 = NASA_LIB:MAX824
U11 = SparkFun:ATTINY45: Atmel ATTiny45
U47 U49 = RJ's parts:MAX6818
U$3 = SparkFun:OSHW-LOGO: Open Source Hardware Logo This logo indicates the piece of hardware it is found on incorporates a OSHW license and/or adheres to the definition of open source hardware found here: http://freedomdefined.org/OSHW
X1 = NASA_LIB:TLA-6T118LF

## Net classes
1 power: width 0.61 mm, drill 0.711 mm, clearance 0.203 mm